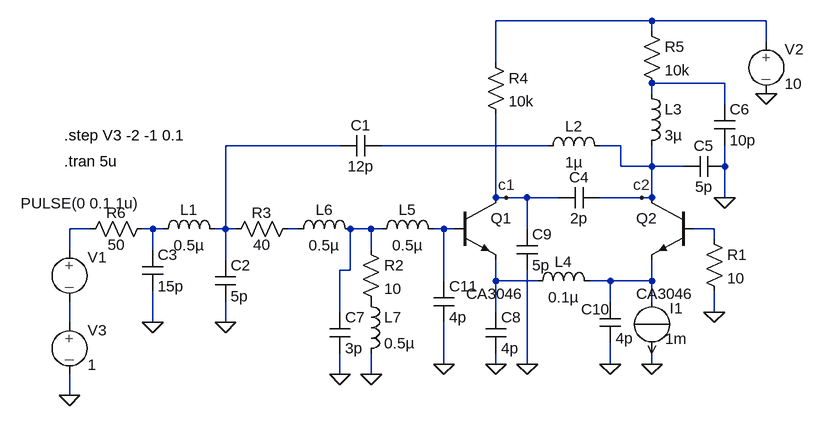
[diagram p0: schematic diff_osc.asc]
diff_osc.asc, the LTspice schematic file:
Version 4
SHEET 1 880 680
WIRE 592 -112 352 -112
WIRE 768 -112 592 -112
WIRE 592 -96 592 -112
WIRE 768 -80 768 -112
WIRE 352 -48 352 -112
WIRE 704 -16 592 -16
WIRE 592 0 592 -16
WIRE 704 16 704 -16
WIRE 112 80 -64 80
WIRE 432 80 176 80
WIRE 544 80 512 80
WIRE 544 112 544 80
WIRE 592 112 592 80
WIRE 592 112 544 112
WIRE 640 112 592 112
WIRE 704 112 704 80
WIRE 352 160 352 32
WIRE 368 160 352 160
WIRE 400 160 368 160
WIRE 448 160 400 160
WIRE 576 160 512 160
WIRE 592 160 592 112
WIRE 592 160 576 160
WIRE 704 160 704 112
WIRE -272 208 -304 208
WIRE -176 208 -192 208
WIRE -160 208 -176 208
WIRE -64 208 -64 80
WIRE -64 208 -80 208
WIRE -48 208 -64 208
WIRE 48 208 32 208
WIRE 160 208 128 208
WIRE 176 208 160 208
WIRE 272 208 256 208
WIRE 288 208 272 208
WIRE 400 208 400 160
WIRE 688 208 656 208
WIRE 688 224 688 208
WIRE -304 240 -304 208
WIRE -176 240 -176 208
WIRE 160 240 160 208
WIRE -64 256 -64 208
WIRE 128 272 128 208
WIRE 128 272 112 272
WIRE 272 288 272 208
WIRE 352 288 352 256
WIRE 416 288 352 288
WIRE 528 288 496 288
WIRE 592 288 592 256
WIRE 592 288 528 288
WIRE 528 320 528 288
WIRE 592 320 592 288
WIRE 112 336 112 272
WIRE 352 336 352 288
WIRE 688 336 688 304
WIRE -304 352 -304 320
WIRE -176 352 -176 304
WIRE -64 352 -64 320
WIRE 272 416 272 352
WIRE 352 416 352 400
WIRE 400 416 400 272
WIRE 528 416 528 384
WIRE 592 416 592 400
WIRE 112 432 112 400
WIRE 160 432 160 400
WIRE -304 464 -304 432
FLAG 688 336 0
FLAG 160 432 0
FLAG 768 0 0
FLAG -304 464 0
FLAG 592 416 0
FLAG 368 160 c1
FLAG 576 160 c2
FLAG -64 352 0
FLAG -176 352 0
FLAG 704 160 0
FLAG 112 432 0
FLAG 352 416 0
FLAG 400 416 0
FLAG 528 416 0
FLAG 272 416 0
SYMBOL EIT_Semiconductors\\npn 288 160 R0
WINDOW 3 18 148 Left 2
SYMATTR Value CA3046
SYMATTR InstName Q1
SYMBOL EIT_Semiconductors\\npn 656 160 M0
WINDOW 3 1 148 Left 2
SYMATTR Value CA3046
SYMATTR InstName Q2
SYMBOL res 672 208 R0
SYMATTR InstName R1
SYMATTR Value 10
SYMBOL res 144 224 R0
SYMATTR InstName R2
SYMATTR Value 10
SYMBOL res -64 224 R270
WINDOW 0 25 56 VTop 2
WINDOW 3 7 56 VBottom 2
SYMATTR InstName R3
SYMATTR Value 40
SYMBOL source-V -304 224 R0
WINDOW 3 -75 -55 Left 2
WINDOW 123 0 0 Left 2
WINDOW 39 0 0 Left 2
SYMATTR Value PULSE(0 0.1 1u)
SYMATTR InstName V1
SYMBOL source-V 768 -96 R0
SYMATTR InstName V2
SYMATTR Value 10
SYMBOL res 336 -64 R0
SYMATTR InstName R4
SYMATTR Value 10k
SYMBOL res 576 -112 R0
SYMATTR InstName R5
SYMATTR Value 10k
SYMBOL source-I 592 400 R180
WINDOW 0 -48 70 Left 2
WINDOW 3 -54 23 Left 2
SYMATTR InstName I1
SYMATTR Value 1m
SYMBOL res -288 224 R270
WINDOW 0 25 56 VTop 2
WINDOW 3 7 56 VBottom 2
SYMATTR InstName R6
SYMATTR Value 50
SYMBOL ind -176 224 R270
WINDOW 0 30 56 VTop 2
WINDOW 3 6 56 VBottom 2
SYMATTR InstName L1
SYMATTR Value 0.5µ
SYMBOL cap 176 64 R90
WINDOW 0 0 32 VBottom 2
WINDOW 3 32 32 VTop 2
SYMATTR InstName C1
SYMATTR Value 12p
SYMBOL cap -80 256 R0
SYMATTR InstName C2
SYMATTR Value 5p
SYMBOL cap -192 240 R0
SYMATTR InstName C3
SYMATTR Value 15p
SYMBOL ind 416 96 R270
WINDOW 0 30 56 VTop 2
WINDOW 3 6 56 VBottom 2
SYMATTR InstName L2
SYMATTR Value 1µ
SYMBOL cap 512 144 R90
WINDOW 0 0 32 VBottom 2
WINDOW 3 32 32 VTop 2
SYMATTR InstName C4
SYMATTR Value 2p
SYMBOL ind 576 -16 R0
SYMATTR InstName L3
SYMATTR Value 3µ
SYMBOL cap 704 96 R90
WINDOW 0 0 32 VBottom 2
WINDOW 3 32 32 VTop 2
SYMATTR InstName C5
SYMATTR Value 5p
SYMBOL cap 688 16 R0
SYMATTR InstName C6
SYMATTR Value 10p
SYMBOL source-V -304 336 R0
SYMATTR InstName V3
SYMATTR Value 1
SYMBOL cap 96 336 R0
SYMATTR InstName C7
SYMATTR Value 3p
SYMBOL cap 336 336 R0
SYMATTR InstName C8
SYMATTR Value 4p
SYMBOL cap 384 208 R0
SYMATTR InstName C9
SYMATTR Value 5p
SYMBOL ind 400 304 R270
WINDOW 0 30 56 VTop 2
WINDOW 3 6 56 VBottom 2
SYMATTR InstName L4
SYMATTR Value 0.1µ
SYMBOL cap 512 320 R0
WINDOW 0 -29 12 Left 2
SYMATTR InstName C10
SYMATTR Value 4p
SYMBOL ind 160 224 R270
WINDOW 0 30 56 VTop 2
WINDOW 3 6 56 VBottom 2
SYMATTR InstName L5
SYMATTR Value 0.5µ
SYMBOL cap 256 288 R0
SYMATTR InstName C11
SYMATTR Value 4p
SYMBOL ind 32 224 R270
WINDOW 0 30 56 VTop 2
WINDOW 3 6 56 VBottom 2
SYMATTR InstName L6
SYMATTR Value 0.5µ
SYMBOL ind 144 304 R0
SYMATTR InstName L7
SYMATTR Value 0.5µ
TEXT -312 104 Left 2 !.tran 5u
TEXT -312 64 Left 2 !.step V3 -2 -1 0.1

The netlist it stands for:
* diff_osc.asc
Q1 c1 N009 N011 0 CA3046
Q2 c2 N010 N012 0 CA3046
R1 N010 0 10
R2 N008 P001 10
R3 N003 N007 40
V1 N005 N013 PULSE(0 0.1 1u)
V2 N001 0 10
R4 N001 c1 10k
R5 N001 N002 10k
I1 N012 0 1m
R6 N005 N006 50
L1 N006 N003 0.5µ
C1 N004 N003 12p
C2 N003 0 5p
C3 N006 0 15p
L2 N004 c2 1µ
C4 c2 c1 2p
L3 N002 c2 3µ
C5 0 c2 5p
C6 N002 0 10p
V3 N013 0 1
C7 N008 0 3p
C8 N011 0 4p
C9 c1 0 5p
L4 N011 N012 0.1µ
C10 N012 0 4p
L5 N008 N009 0.5µ
C11 N009 0 4p
L6 N007 N008 0.5µ
L7 P001 0 0.5µ
.model NPN NPN
.model PNP PNP
.lib standard.bjt
.tran 5u
.step V3 -2 -1 0.1
.backanno
.end